# EAGLE schematic Smartglove_IMU_FIX_Connections (EAGLE 9.2.0)
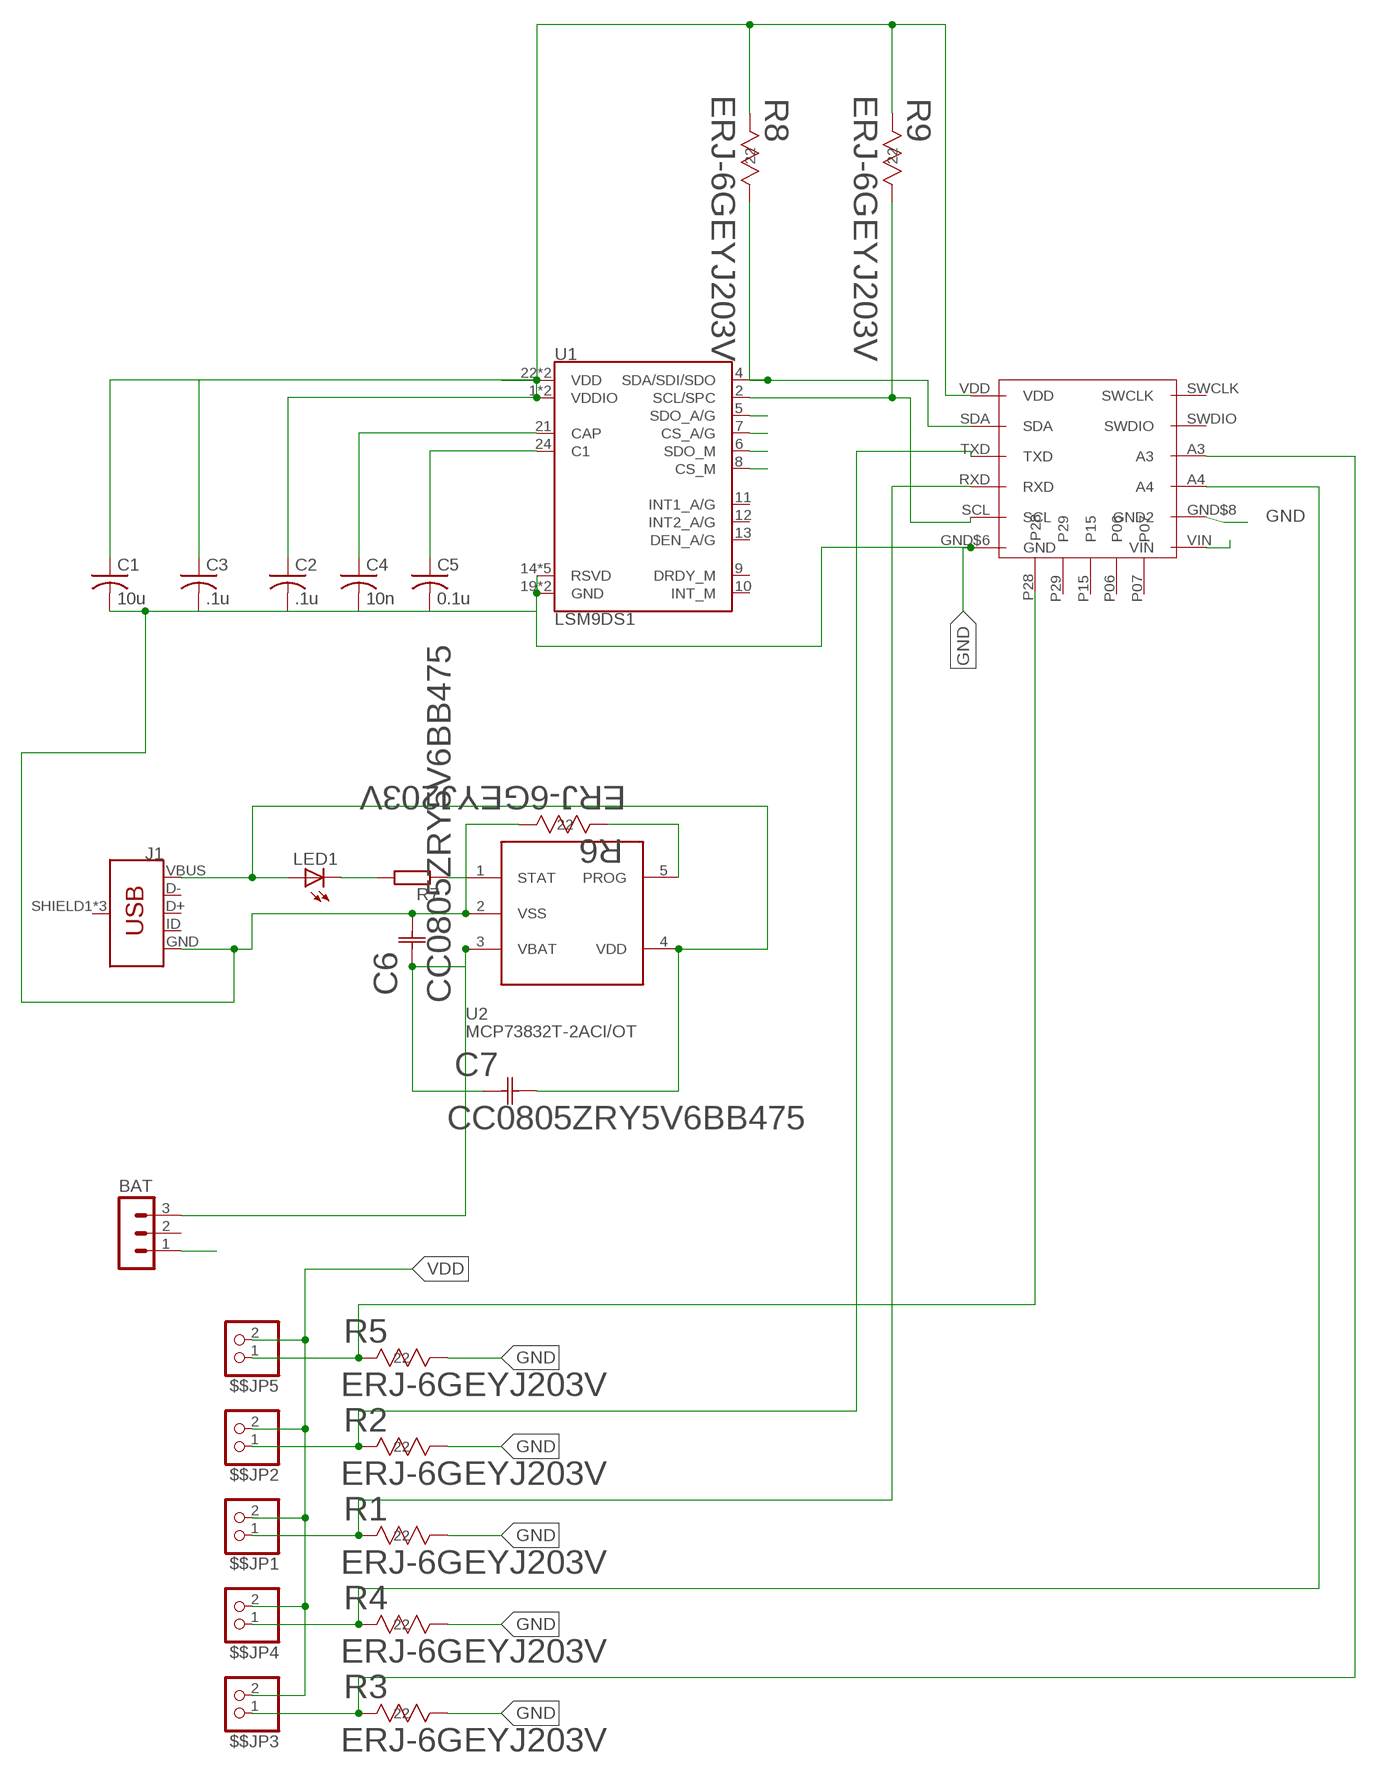
[diagram p0: schematic, sheet 1]

## Parts
$$JP1  PINHD-1X2  [1X02]
$$JP2  PINHD-1X2  [1X02]
$$JP3  PINHD-1X2  [1X02]
$$JP4  PINHD-1X2  [1X02]
$$JP5  PINHD-1X2  [1X02]
BAT  MA03-1  [MA03-1]
C1  10u  C-USC0603  [C0603]
C2  .1u  C-USC0603  [C0603]
C3  .1u  C-USC0603  [C0603]
C4  10n  C-USC0603  [C0603]
C5  0.1u  C-USC0603  [C0603]
C6  CC0805ZRY5V6BB475  [YAG_CC0805]
C7  CC0805ZRY5V6BB475  [YAG_CC0805]
J1  USB_MICRO-B_FEMALE-SMT  [USB-B-MICRO-SMD]
LED1  LEDCHIPLED_0603  [CHIPLED_0603]
R1  ERJ-6GEYJ203V  [RC0805N]
R2  ERJ-6GEYJ203V  [RC0805N]
R3  ERJ-6GEYJ203V  [RC0805N]
R4  ERJ-6GEYJ203V  [RC0805N]
R5  ERJ-6GEYJ203V  [RC0805N]
R6  ERJ-6GEYJ203V  [RC0805N]
R7  R-EU_R0603  [R0603]
R8  ERJ-6GEYJ203V  [RC0805N]
R9  ERJ-6GEYJ203V  [RC0805N]
U1  LSM9DS1  [LGA-24-3.5X3]
U2  MCP73832T-2ACI/OT  [SOT23-5]
U$1  BLE-NANO  [BLE-NANO-PKG]

## Nets
AN1: $$JP5.1 R5.2 U$1.P28
AN2: $$JP2.1 R2.2 U$1.TXD
AN3: $$JP1.1 R1.2 U$1.RXD
AN4: $$JP4.1 R4.2 U$1.A4
AN5: $$JP3.1 R3.2 U$1.A3
GND: C1.2 C2.2 C3.2 C4.2 C5.2 C6.2 J1.GND R1.1 R2.1 R3.1 R4.1 R5.1 R6.1 U1.14(RSVD) U1.15(RSVD) U1.16(RSVD) U1.17(RSVD) U1.18(RSVD) U1.19(GND) U1.20(GND) U2.2(VSS) U$1.GND$6(GND) U$1.GND$8(GND2)
N$5: C5.1 U1.24(C1)
N$6: C4.1 U1.21(CAP)
N$8: LED1.C R7.2
N$9: R7.1 U2.1(STAT)
N$16: R6.2 U2.5(PROG)
SCL: R9.1 U1.2(SCL/SPC) U$1.SCL
SDA: R8.1 U1.4(SDA/SDI/SDO) U$1.SDA
VBAT: BAT.3 C6.1 C7.1 U2.3(VBAT)
VBUS: C7.2 J1.VBUS LED1.A U2.4(VDD)
VDD: $$JP1.2 $$JP2.2 $$JP3.2 $$JP4.2 $$JP5.2 C1.1 C2.1 C3.1 R8.2 R9.2 U1.1(VDDIO) U1.3(VDDIO) U1.5(SDO_A/G) U1.6(SDO_M) U1.7(CS_A/G) U1.8(CS_M) U1.22(VDD) U1.23(VDD) U$1.VDD
VIN: BAT.1 U$1.VIN
Unconnected: BAT.2 J1.D+ J1.D- J1.ID J1.SHIELD1(SHIELD) J1.SHIELD2(SHIELD) J1.SHIELD3(SHIELD) U1.9(DRDY_M) U1.10(INT_M) U1.11(INT1_A/G) U1.12(INT2_A/G) U1.13(DEN_A/G) U$1.P06 U$1.P07 U$1.P15 U$1.P29 U$1.SWCLK U$1.SWDIO

## Library data of the parts
$$JP1-$$JP5 = pinhead:PINHD-1X2: PIN HEADER
BAT = con-lstb:MA03-1: PIN HEADER; OC_FARNELL: unknown; OC_NEWARK: unknown
C1-C5 = rcl:C-US: CAPACITOR, American symbol; SPICEPREFIX: C
C6 C7 = Yageo 4.7uF Cap:CC0805ZRY5V6BB475; MANUFACTURER_PART_NUMBER: CC0805ZRY5V6BB475; VENDOR: Yageo
J1 = SparkFun-Connectors:USB_MICRO-B: USB Type Micro-B Connector Male/female and PTH/SMT variants SparkFun Products: SparkFun microB USB Breakout <https://www.sparkfun.com/products/12035> SparkFun USB microB Plug Breakout <https://www.sparkfun.com/products/10031> SparkFun ESP8266 Thing <https://www.sparkfun.com/products/13231>; PROD_ID: CONN-11752
LED1 = led:LED: LED OSRAM: - CHIPLED LG R971, LG N971, LY N971, LG Q971, LY Q971, LO R971, LY R971 LH N974, LH R974 LS Q976, LO Q976, LY Q976 LO Q996 - Hyper CHIPLED LW Q18S LB Q993, LB Q99A, LB R99A - SideLED LS A670, LO A670, LY A670, LG A670, LP A670 LB A673, LV A673, LT A673, LW A673 LH A674 LY A675 LS A676, LA A676, LO A676, LY A676, LW A676 LS A679, LY A679, LG A679 - Hyper Micro SIDELED® LS Y876, LA Y876, LO Y876, LY Y876 LT Y87S - SmartLED LW L88C, LW L88S LB L89C, LB L89S, LG L890 LS L89K, LO L89K, LY L89K LS L896, LA L896, LO L896, LY L896 - TOPLED LS T670, LO T670, LY T670, LG T670, LP T670 LSG T670, LSP T670, LSY T670, LOP T670, LYG T670 LG T671, LOG T671, LSG T671 LB T673, LV T673, LT T673, LW T673 LH T674 LS T676, LA T676, LO T676, LY T676, LB T676, LH T676, LSB T676, LW T676 LB T67C, LV T67C, LT T67C, LS T67K, LO T67K, LY T67K, LW E67C LS E67B, LA E67B, LO E67B, LY E67B, LB E67C, LV E67C, LT E67C LW T67C LS T679, LY T679, LG T679 LS T770, LO T770, LY T770, LG T770, LP T770 LB T773, LV T773, LT T773, LW T773 LH T774 LS E675, LA E675, LY E675, LS T675 LS T776, LA T776, LO T776, LY T776, LB T776 LHGB T686 LT T68C, LB T68C - Hyper Mini TOPLED® LB M676 - Mini TOPLED Santana® LG M470 LS M47K, LO M47K, LY M47K Source: http://www.osram.convergy.de LUXEON: - LUMILED® LXK2-PW12-R00, LXK2-PW12-S00, LXK2-PW14-U00, LXK2-PW14-V00 LXK2-PM12-R00, LXK2-PM12-S00, LXK2-PM14-U00 LXK2-PE12-Q00, LXK2-PE12-R00, LXK2-PE12-S00, LXK2-PE14-T00, LXK2-PE14-U00 LXK2-PB12-K00, LXK2-PB12-L00, LXK2-PB12-M00, LXK2-PB14-N00, LXK2-PB14-P00, LXK2-PB14-Q00 LXK2-PR12-L00, LXK2-PR12-M00, LXK2-PR14-Q00, LXK2-PR14-R00 LXK2-PD12-Q00, LXK2-PD12-R00, LXK2-PD12-S00 LXK2-PH12-R00, LXK2-PH12-S00 LXK2-PL12-P00, LXK2-PL12-Q00, LXK2-PL12-R00 Source: www.luxeon.com KINGBRIGHT: KA-3528ASYC Source: www.kingbright.com
R1-R6 R8 R9 = Panasonic 20K Res:ERJ-6GEYJ203V; MANUFACTURER_PART_NUMBER: ERJ6GEYJ203V; VENDOR: Panasonic
R7 = rcl:R-EU_: RESISTOR, European symbol; SPICEPREFIX: R
U1 = SparkFun-Sensors:LSM9DS1: ST Microelectronics LSM9DS1 9DOF IMU - Accelerometer, Gyroscope & Magnetometer The LSM9DS1 is a versatile, motion-sensing system-in-a-chip. It houses a 3-axis accelerometer, 3-axis gyroscope, and 3-axis magnetometer – nine degrees of freedom (9DOF) in a single IC! The LSM9DS1 is equipped with a digital interface, but even that is flexible: it supports both I2C and SPI, so you’ll be hard-pressed to find a microcontroller it doesn’t work with. Datasheet <https://cdn.sparkfun.com/assets/learn_tutorials/3/7/3/LSM9DS1_Datasheet.pdf> SparkFun Products SparkFun 9 Degrees of Freedom IMU Breakout - LSM9DS1 <https://www.sparkfun.com/products/13284> (SEN-13284) SparkFun Photon IMU Shield <https://www.sparkfun.com/products/13629> (DEV-13629); PROD_ID: IC-12536
U2 = MCP73832T-2ACI_OT:MCP73832T-2ACI/OT: http://octopart.com/mcp73832t-2aci%2Fot-microchip-664172; AVAILABILITY: Unavailable; MF: Microchip; MP: MCP73832T-2ACI-OT; PACKAGE: SOT-23-5 Microchip; PRICE: None
U$1 = BLE-NANO:BLE-NANO